# EAGLE schematic flasher (EAGLE 7.3.0)
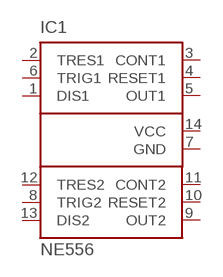
[diagram p0: schematic, sheet 1]

## Parts
IC1  NE556  [DIL14]
Unconnected: IC1.1(DIS1) IC1.2(TRES1) IC1.3(CONT1) IC1.4(RESET1) IC1.5(OUT1) IC1.6(TRIG1) IC1.8(TRIG2) IC1.9(OUT2) IC1.10(RESET2) IC1.11(CONT2) IC1.12(TRES2) IC1.13(DIS2)

## Power pins joined to a net without a drawn wire
GND: IC1.7(GND)
VCC: IC1.14(VCC)

## Library data of the parts
IC1 = st-microelectronics:NE556: General Purpose Biopolartimer; MPN: NE556; OC_FARNELL: 2349784; OC_NEWARK: 83C0108